# Altium schematic sheet FPGA.SchDoc
size A4; SheetNumber: 2; SheetTotal: 5
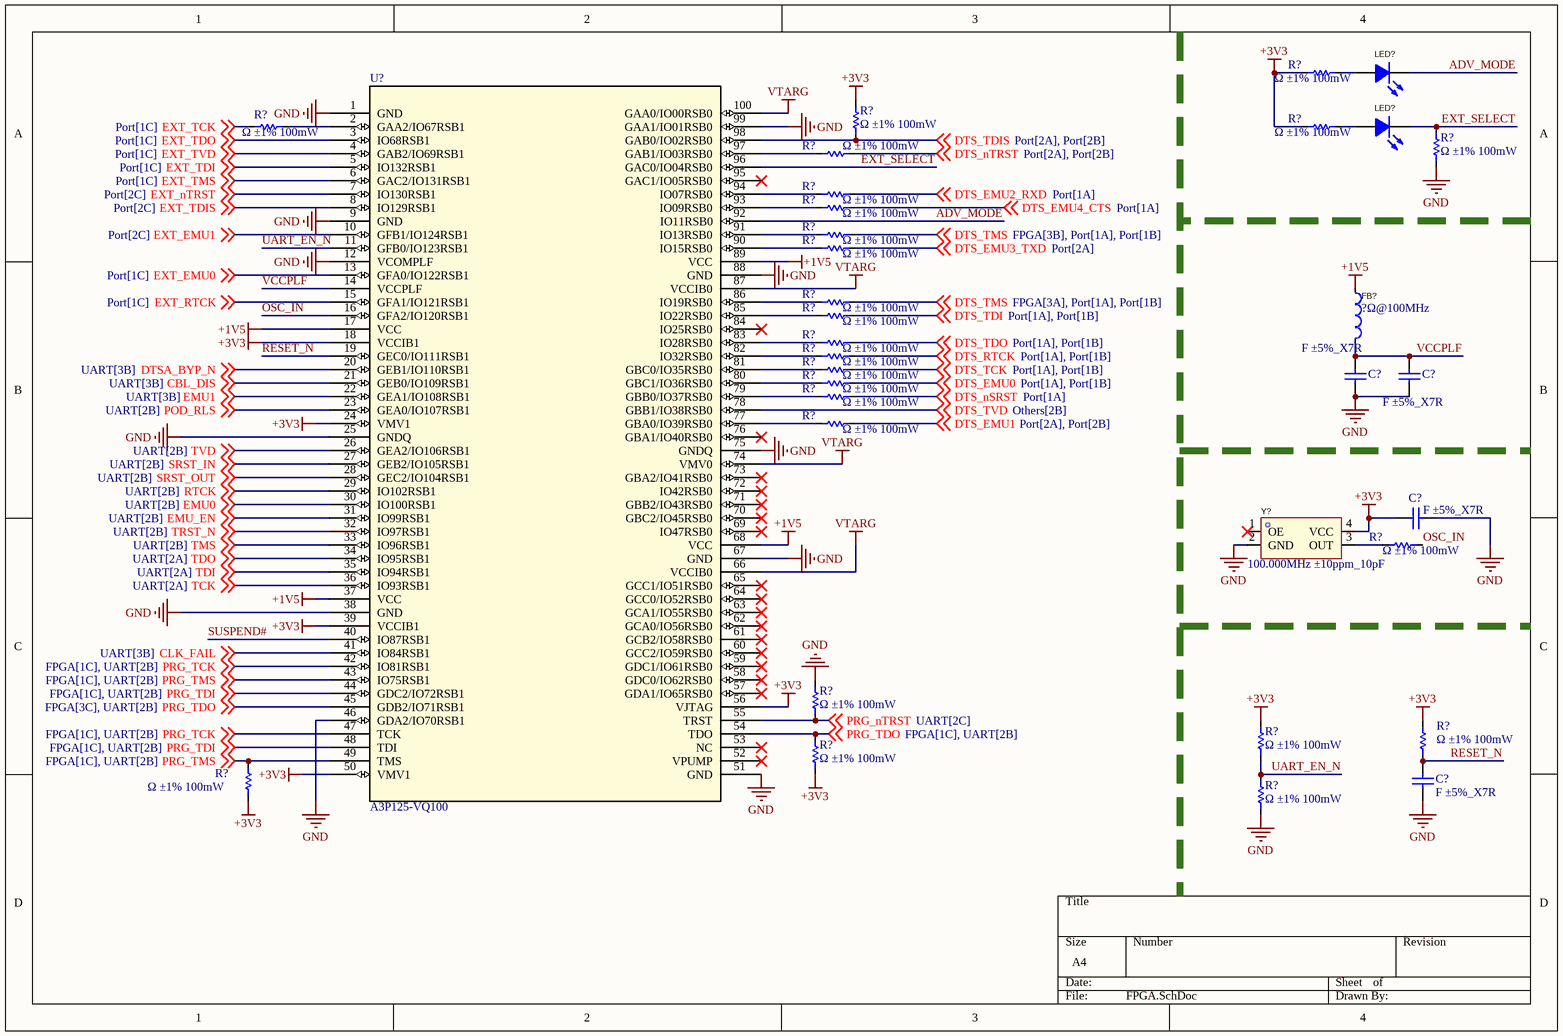
[diagram p0: FPGA.SchDoc]

## Parts
(Parts that share a designator on the sheet are numbered #1, #2 ... from top to bottom, then left to right.)
C?#1  F ±5%_X7R  [C0805]
C?#2  F ±5%_X7R  [C0805]
C?#3  F ±5%_X7R  [C0805]
C?#4  F ±5%_X7R  [C0805]
FB?  ?Ω@100MHz  [L0603]
LED?#1  LED  [LED0603-RD]  (value not drawn)
LED?#2  LED  [LED0603-RD]  (value not drawn)
R?#1  Ω ±1% 100mW  [R0603]
R?#2  Ω ±1% 100mW  [R0603]
R?#3  Ω ±1% 100mW  [R0603]
R?#4  Ω ±1% 100mW  [R0603]
R?#5  Ω ±1% 100mW  [R0603]
R?#6  Ω ±1% 100mW  [R0603]
R?#7  Ω ±1% 100mW  [R0603]
R?#8  Ω ±1% 100mW  [R0603]
R?#9  Ω ±1% 100mW  [R0603]
R?#10  Ω ±1% 100mW  [R0603]
R?#11  Ω ±1% 100mW  [R0603]
R?#12  Ω ±1% 100mW  [R0603]
R?#13  Ω ±1% 100mW  [R0603]
R?#14  Ω ±1% 100mW  [R0603]
R?#15  Ω ±1% 100mW  [R0603]
R?#16  Ω ±1% 100mW  [R0603]
R?#17  Ω ±1% 100mW  [R0603]
R?#18  Ω ±1% 100mW  [R0603]
R?#19  Ω ±1% 100mW  [R0603]
R?#20  Ω ±1% 100mW  [R0603]
R?#21  Ω ±1% 100mW  [R0603]
R?#22  Ω ±1% 100mW  [R0603]
R?#23  Ω ±1% 100mW  [R0603]
R?#24  Ω ±1% 100mW  [R0603]
R?#25  Ω ±1% 100mW  [R0603]
U?  A3P125-VQ100  [VQ100_MCH]
Y?  100.000MHz ±10ppm_10pF  [OSC-SMD_4P-L3.2-W2.5-BL_SIT8008BI]

## Nets
+1V5: FB?.1 U?.17(VCC) U?.37(VCC) U?.68(VCC) U?.89(VCC)
+3V3: C?#3.1 R?#1.1 R?#2.1 R?#3.2 R?#21.2 R?#22.2 R?#23.2 R?#24.1 U?.18(VCCIB1) U?.24(VMV1) U?.39(VCCIB1) U?.50(VMV1) U?.56(VJTAG) Y?.4(VCC)
GND: C?#1.1 C?#2.1 C?#3.2 C?#4.1 R?#6.1 R?#20.2 R?#25.1 U?.1(GND) U?.9(GND) U?.12(VCOMPLF) U?.25(GNDQ) U?.38(GND) U?.46(GDA2/IO70RSB1) U?.51(GND) U?.67(GND) U?.75(GNDQ) U?.88(GND) U?.99(GAA1/IO01RSB0) Y?.2(GND)
VTARG: U?.66(VCCIB0) U?.74(VMV0) U?.87(VCCIB0) U?.100(GAA0/IO00RSB0)
ADV_MODE: LED?#1.2(K) U?.92(IO11RSB0)
CBL_DIS: U?.21(GEB0/IO109RSB1) ; off-sheet CBL_DIS
CLK_FAIL: U?.41(IO84RSB1) ; off-sheet CLK_FAIL
DTS_EMU0: R?#16.2 ; off-sheet DTS_EMU0
DTS_EMU1: R?#18.2 ; off-sheet DTS_EMU1
DTS_EMU2_RXD: R?#7.2 ; off-sheet DTS_EMU2_RXD
DTS_EMU3_TXD: R?#10.2 ; off-sheet DTS_EMU3_TXD
DTS_EMU4_CTS: R?#8.2 ; off-sheet DTS_EMU4_CTS
DTS_nSRST: R?#17.2 ; off-sheet DTS_nSRST
DTS_nTRST: R?#5.2 ; off-sheet DTS_nTRST
DTS_RTCK: R?#14.2 ; off-sheet DTS_RTCK
DTS_TCK: R?#15.2 ; off-sheet DTS_TCK
DTS_TDI: R?#12.2 ; off-sheet DTS_TDI
DTS_TDIS: R?#3.1 U?.98(GAB0/IO02RSB0) ; off-sheet DTS_TDIS
DTS_TDO: R?#13.2 ; off-sheet DTS_TDO
DTS_TMS: R?#9.2 R?#11.2 ; off-sheet DTS_TMS
DTS_TVD: U?.78(GBB1/IO38RSB0) ; off-sheet DTS_TVD
DTSA_BYP_N: U?.20(GEB1/IO110RSB1) ; off-sheet DTSA_BYP_N
EMU0: U?.30(IO100RSB1) ; off-sheet EMU0
EMU1: U?.22(GEA1/IO108RSB1) ; off-sheet EMU1
EMU_EN: U?.31(IO99RSB1) ; off-sheet EMU_EN
EXT_EMU0: U?.13(GFA0/IO122RSB1) ; off-sheet EXT_EMU0
EXT_EMU1: U?.10(GFB1/IO124RSB1) ; off-sheet EXT_EMU1
EXT_nTRST: U?.7(IO130RSB1) ; off-sheet EXT_nTRST
EXT_RTCK: U?.15(GFA1/IO121RSB1) ; off-sheet EXT_RTCK
EXT_SELECT: LED?#2.2(K) R?#6.2 U?.96(GAC0/IO04RSB0)
EXT_TCK: R?#4.2 ; off-sheet EXT_TCK
EXT_TDI: U?.5(IO132RSB1) ; off-sheet EXT_TDI
EXT_TDIS: U?.8(IO129RSB1) ; off-sheet EXT_TDIS
EXT_TDO: U?.3(IO68RSB1) ; off-sheet EXT_TDO
EXT_TMS: U?.6(GAC2/IO131RSB1) ; off-sheet EXT_TMS
EXT_TVD: U?.4(GAB2/IO69RSB1) ; off-sheet EXT_TVD
OSC_IN: R?#19.1 U?.16(GFA2/IO120RSB1)
POD_RLS: U?.23(GEA0/IO107RSB1) ; off-sheet POD_RLS
PRG_nTRST: R?#20.1 U?.55(TRST) ; off-sheet PRG_nTRST
PRG_TCK: U?.42(IO81RSB1) U?.47(TCK) ; off-sheet PRG_TCK
PRG_TDI: U?.44(GDC2/IO72RSB1) U?.48(TDI) ; off-sheet PRG_TDI
PRG_TDO: R?#21.1 U?.45(GDB2/IO71RSB1) U?.54(TDO) ; off-sheet PRG_TDO
PRG_TMS: R?#24.2 U?.43(IO75RSB1) U?.49(TMS) ; off-sheet PRG_TMS
RESET_N: C?#4.2 R?#23.1 U?.19(GEC0/IO111RSB1)
RTCK: U?.29(IO102RSB1) ; off-sheet RTCK
SRST_IN: U?.27(GEB2/IO105RSB1) ; off-sheet SRST_IN
SRST_OUT: U?.28(GEC2/IO104RSB1) ; off-sheet SRST_OUT
SUSPEND#: U?.40(IO87RSB1)
TCK: U?.36(IO93RSB1) ; off-sheet TCK
TDI: U?.35(IO94RSB1) ; off-sheet TDI
TDO: U?.34(IO95RSB1) ; off-sheet TDO
TMS: U?.33(IO96RSB1) ; off-sheet TMS
TRST_N: U?.32(IO97RSB1) ; off-sheet TRST_N
TVD: U?.26(GEA2/IO106RSB1) ; off-sheet TVD
UART_EN_N: R?#22.1 R?#25.2 U?.11(GFB0/IO123RSB1)
VCCPLF: C?#1.2 C?#2.2 FB?.2 U?.14(VCCPLF)
NetLED?#1_1: LED?#1.1(A) R?#1.2
NetLED?#2_1: LED?#2.1(A) R?#2.2
NetR?#4_1: R?#4.1 U?.2(GAA2/IO67RSB1)
NetR?#5_1: R?#5.1 U?.97(GAB1/IO03RSB0)
NetR?#7_1: R?#7.1 U?.94(IO07RSB0)
NetR?#8_1: R?#8.1 U?.93(IO09RSB0)
NetR?#9_1: R?#9.1 U?.91(IO13RSB0)
NetR?#10_1: R?#10.1 U?.90(IO15RSB0)
NetR?#11_1: R?#11.1 U?.86(IO19RSB0)
NetR?#12_1: R?#12.1 U?.85(IO22RSB0)
NetR?#13_1: R?#13.1 U?.83(IO28RSB0)
NetR?#14_1: R?#14.1 U?.82(IO32RSB0)
NetR?#15_1: R?#15.1 U?.81(GBC0/IO35RSB0)
NetR?#16_1: R?#16.1 U?.80(GBC1/IO36RSB0)
NetR?#17_1: R?#17.1 U?.79(GBB0/IO37RSB0)
NetR?#18_1: R?#18.1 U?.77(GBA0/IO39RSB0)
NetR?#19_2: R?#19.2 Y?.3(OUT)

Not connected (* = marked no-connect by the designer): U? 52(VPUMP)* 53(NC)* 57(GDA1/IO65RSB0)* 58(GDC0/IO62RSB0)* 59(GDC1/IO61RSB0)* 60(GCC2/IO59RSB0)* 61(GCB2/IO58RSB0)* 62(GCA0/IO56RSB0)* 63(GCA1/IO55RSB0)* 64(GCC0/IO52RSB0)* 65(GCC1/IO51RSB0)* 69(IO47RSB0)* 70(GBC2/IO45RSB0)* 71(GBB2/IO43RSB0)* 72(IO42RSB0)* 73(GBA2/IO41RSB0)* 76(GBA1/IO40RSB0)* 84(IO25RSB0)* 95(GAC1/IO05RSB0)*; Y? 1(OE)*

## Library data of the parts
C?#1-C?#4 = Cap: Capacitor; Published: 8-Jun-2000; LatestRevisionDate: 17-Jul-2002; LatestRevisionNote: Re-released for DXP Platform.; PackageReference: RAD-0.3; Publisher: Altium Limited; PackageDescription: Radial Cap, Thru-Hole; 2 Leads; 0.3 in Pin Spacing
FB? = Ferrite Bead: 标称阻抗@测试频率:600Ω@100MHz;误差:±25%;直流电阻(RDC):250mΩ;额定电流:2A; Manufacturer: FH(风华); Name: CBW321609U601T; Add into BOM: yes; Tolerance: ±25%; DC Resistance: 250mΩ; Current Rating: 2A; Circuits: 1; Symbol: CBW321609U601T; Device: CBW321609U601T; LCSC Part Name: 600Ω@100MHz ±25%; Supplier Part: C73732; Manufacturer Part: CBW321609U601T; Supplier Footprint: SMD; JLCPCB Part Class: Extended Part; Datasheet: https://atta.szlcsc.com/upload/public/pdf/source/20160606/1465200211209.pdf; Supplier: LCSC; Convert to PCB: yes; Impedance @ Frequency: 600Ω@100MHz
LED?#1 LED?#2 = LED: 发光颜色:; Manufacturer: EVERLIGHT(亿光); Name: 17-21SURC/S530-A2/TR8; Add into BOM: yes; Emitted Color: 红灯; Symbol: 17-21SURC/S530-A2/TR8; Device: 17-21SURC/S530-A2/TR8; LCSC Part Name: 红灯; Supplier Part: C131244; Manufacturer Part: 17-21SURC/S530-A2/TR8; Supplier Footprint: 0805; JLCPCB Part Class: Extended Part; Datasheet: https://atta.szlcsc.com/upload/public/pdf/source/20170918/C131244_1505726880590976254.pdf; Supplier: LCSC; Convert to PCB: yes
R?#1-R?#25 = Res: Resistor; Published: 8-Jun-2000; LatestRevisionDate: 17-Jul-2002; LatestRevisionNote: Re-released for DXP Platform.; PackageReference: AXIAL-0.3; Publisher: Altium Limited; PackageDescription: Axial Device, Thru-Hole; 2 Leads; 0.3 in Pin Spacing
U? = A3P125-VQ100: https://www.microchip.com/en-us/product/A3P125#; Mfr_Name: Microchip; RefDes: RefDes; Type: Type
Y? = oscillator: Manufacturer: EPSON(爱普生); Name: 100MHz; Symbol: SG-8101CE-100.000000MHZ-TCHPA; Device: SG-8101CE 100.000000MHz TCHPA; Add into BOM: yes; Value: 100MHz; Frequency Stability: ±20ppm; Supply Voltage: 1.8V~3.3V; LCSC Part Name: 3225 100MHz 1.8~3.3V 20ppm  OE  SMD_4P -40~+105℃; Supplier Part: C390559; Manufacturer Part: SG-8101CE 100.000000MHz TCHPA; Supplier Footprint: SMD3225-4P; JLCPCB Part Class: Extended Part; Datasheet: https://atta.szlcsc.com/upload/public/pdf/source/20190626/C390559_D0305530A2A3721045533DB4F9788766.pdf; Supplier: LCSC; Convert to PCB: yes; Operating Temperature: -40℃~+105℃